# Altium project PCB_Projectmain.PrjPCB
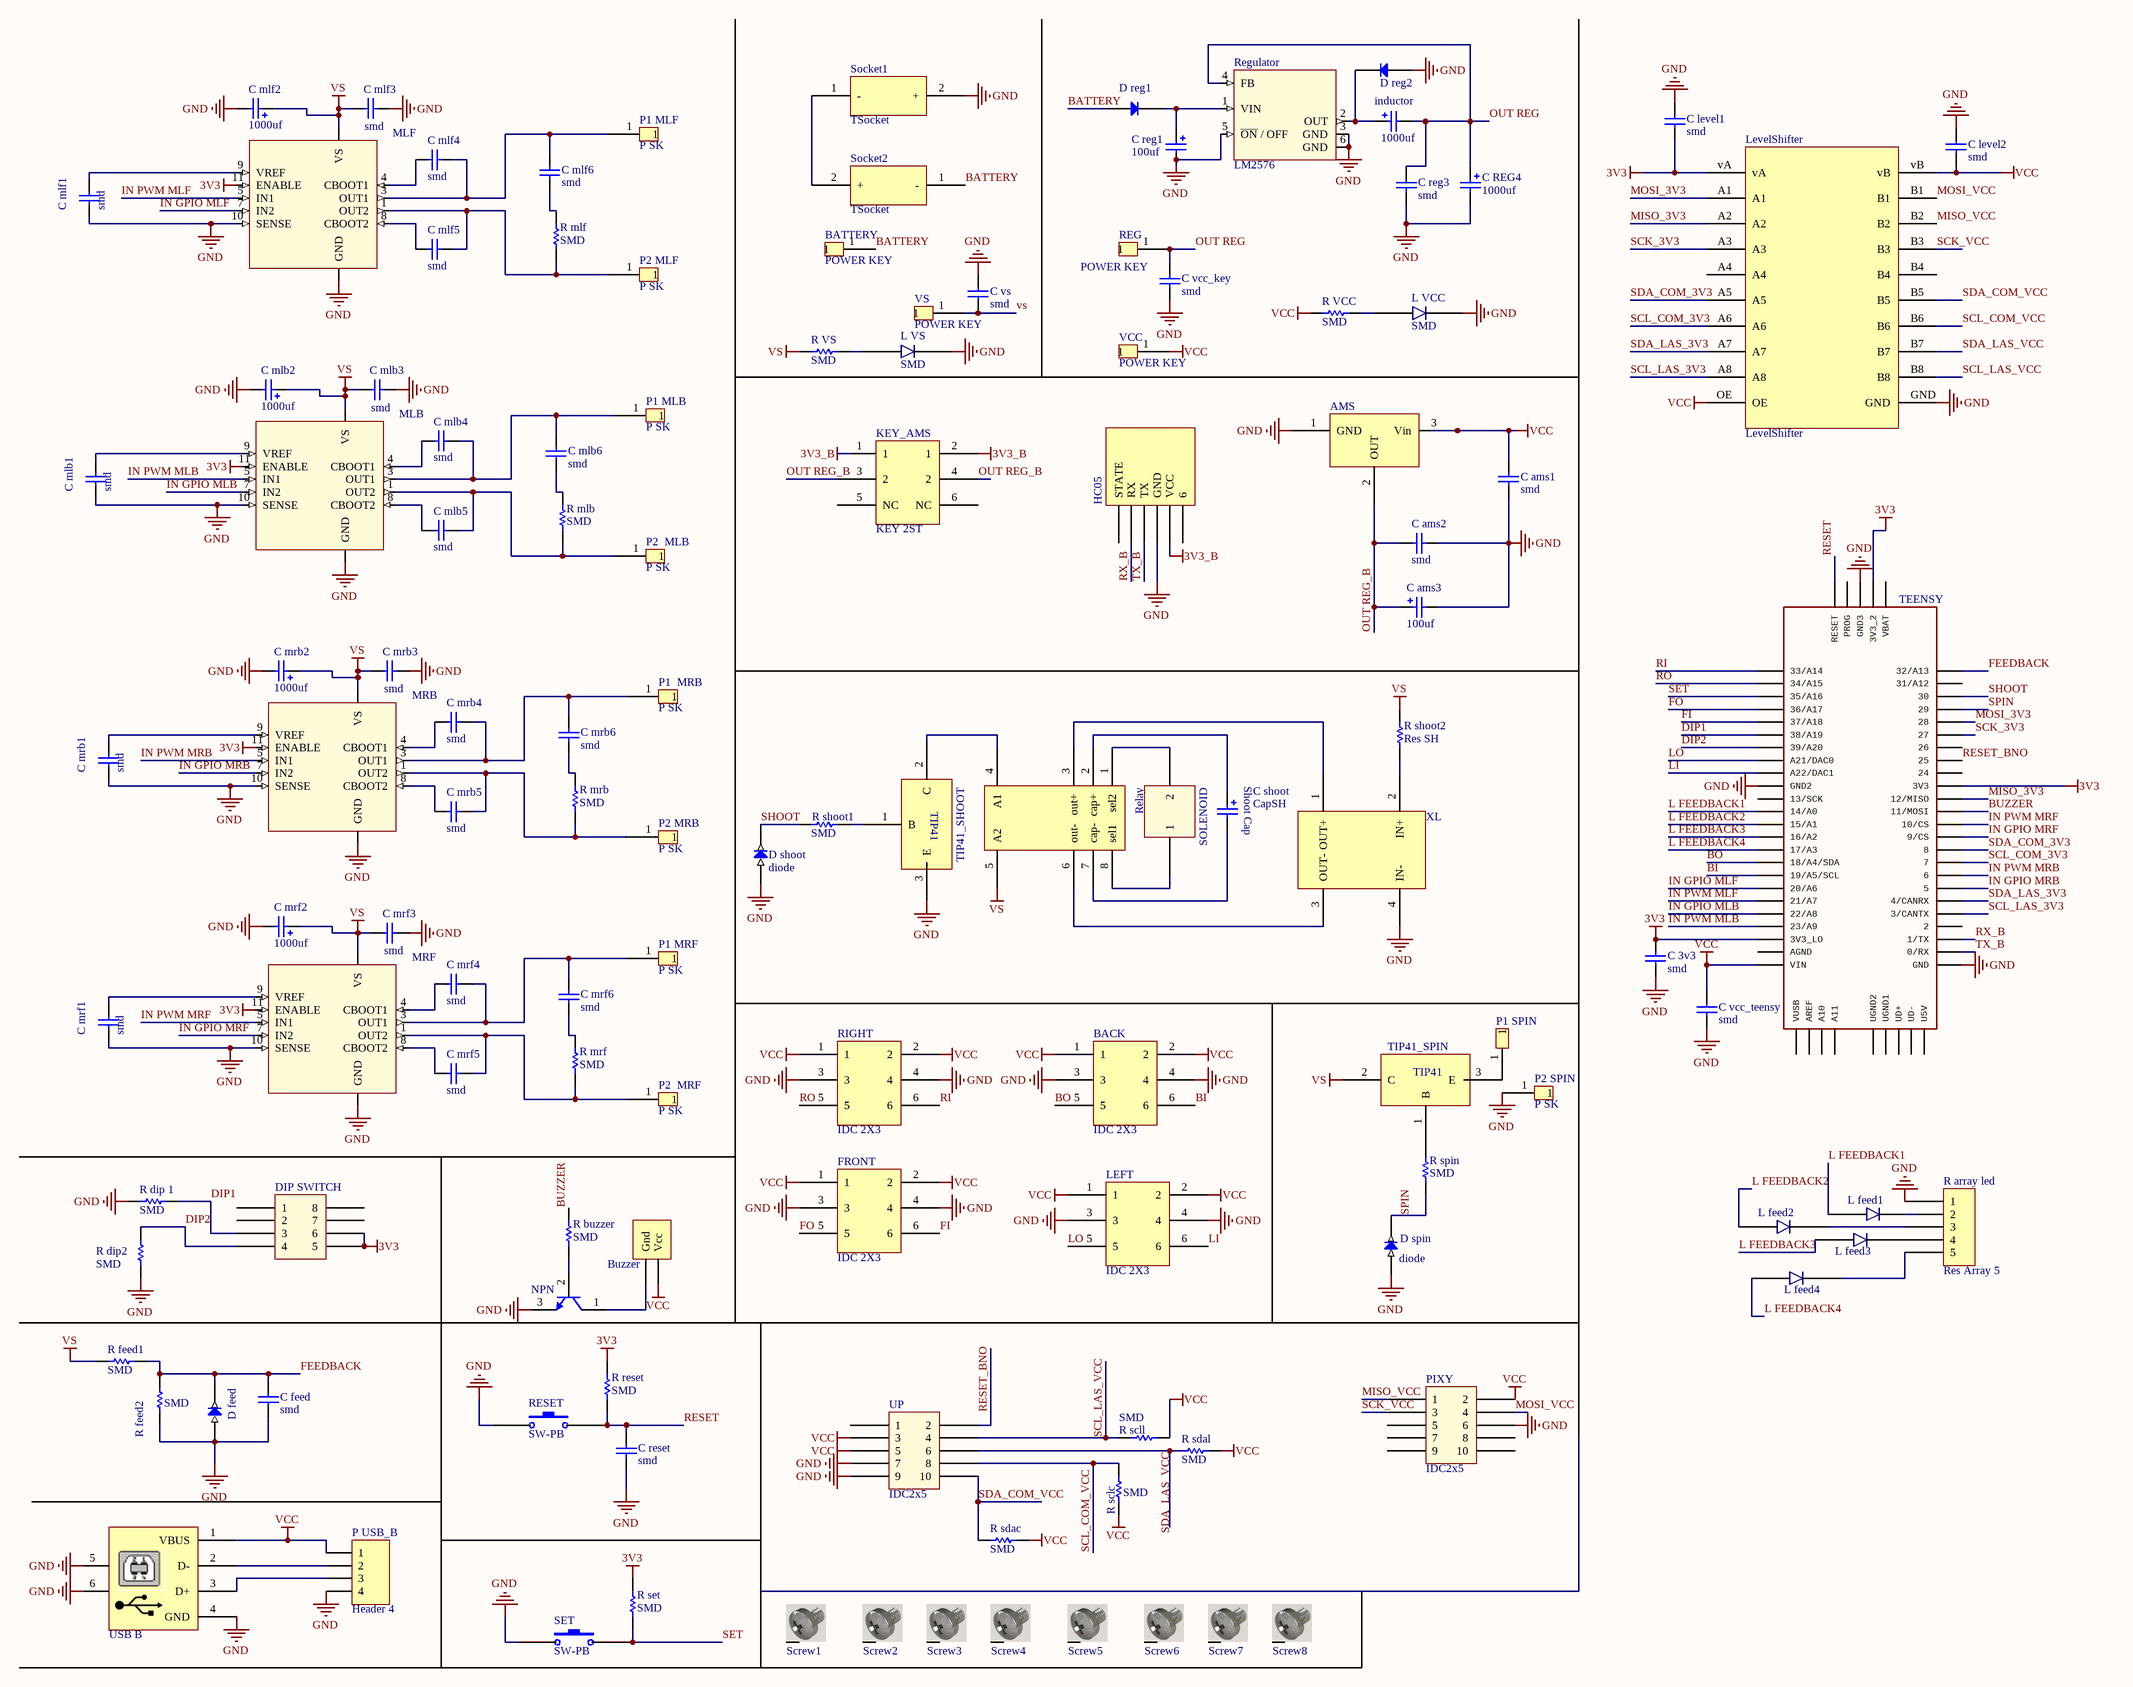
[diagram p0: main schematic.SchDoc]
1 sheet, 124 parts. Net scope: global (net labels, ports and power ports of the same name join across sheets).
Board file: main PCB .PcbDoc

## Sheet main schematic.SchDoc
size A0

### Parts
AMS  AMS1117  [SOT223]  (value not drawn)
BACK  IDC 2X3  [IDC 2X3]
BATTERY  POWER KEY  [P SK]
Buzzer  Buzzer  [Buzzer]  (value not drawn)
C_3v3  smd  [Cap SMD]
C_ams1  smd  [Cap SMD]
C_ams2  smd  [Cap SMD]
C_ams3  100uf  [Cap 100uF]
C_feed  smd  [Cap SMD]
C_level1  smd  [Cap SMD]
C_level2  smd  [Cap SMD]
C_mlb1  smd  [Cap SMD]
C_mlb2  1000uf  [Cap 1000uf]
C_mlb3  smd  [Cap SMD]
C_mlb4  smd  [Cap SMD]
C_mlb5  smd  [Cap SMD]
C_mlb6  smd  [Cap SMD]
C_mlf1  smd  [Cap SMD]
C_mlf2  1000uf  [Cap 1000uf]
C_mlf3  smd  [Cap SMD]
C_mlf4  smd  [Cap SMD]
C_mlf5  smd  [Cap SMD]
C_mlf6  smd  [Cap SMD]
C_mrb1  smd  [Cap SMD]
C_mrb2  1000uf  [Cap 1000uf]
C_mrb3  smd  [Cap SMD]
C_mrb4  smd  [Cap SMD]
C_mrb5  smd  [Cap SMD]
C_mrb6  smd  [Cap SMD]
C_mrf1  smd  [Cap SMD]
C_mrf2  1000uf  [Cap 1000uf]
C_mrf3  smd  [Cap SMD]
C_mrf4  smd  [Cap SMD]
C_mrf5  smd  [Cap SMD]
C_mrf6  smd  [Cap SMD]
C_reg1  100uf  [Cap 100uF]
C_reg3  smd  [Cap SMD]
C_REG4  1000uf  [Cap 1000uf]
C_reset  smd  [Cap SMD]
C_shoot  CapSH  [Cap SH]
C_vcc_key  smd  [Cap SMD]
C_vcc_teensy  smd  [Cap SMD]
C_vs  smd  [Cap SMD]
D_feed  (no value)  [LED SMD]
D_reg1  Diode  [Diode]  (value not drawn)
D_reg2  Diode  [Diode]  (value not drawn)
D_shoot  diode  [LED SMD]
D_spin  diode  [LED SMD]
DIP_SWITCH  DIP4  [DIP SW4]  (value not drawn)
FRONT  IDC 2X3  [IDC 2X3]
HC05  HC05  [HC05]
inductor  1000uf  [Cap 1000uf]
KEY_AMS  KEY 2ST  [KEY 2ST]
L_feed1  SMD  [LED SMD]  (value not drawn)
L_feed2  SMD  [LED SMD]  (value not drawn)
L_feed3  SMD  [LED SMD]  (value not drawn)
L_feed4  SMD  [LED SMD]  (value not drawn)
L_VCC  SMD  [LED SMD]
L_VS  SMD  [LED SMD]
LEFT  IDC 2X3  [IDC 2X3]
LevelShifter  LevelShifter  [CJMCU]
MLB  L6203  [MultiWatt11]  (value not drawn)
MLF  L6203  [MultiWatt11]  (value not drawn)
MRB  L6203  [MultiWatt11]  (value not drawn)
MRF  L6203  [MultiWatt11]  (value not drawn)
NPN  N2222A  [NPN]  (value not drawn)
P1_MLB  P SK  [P SK]
P1_MLF  P SK  [P SK]
P1_MRB  P SK  [P SK]
P1_MRF  P SK  [P SK]
P1_SPIN  P SK  [P SK]  (value not drawn)
P2_MLB  P SK  [P SK]
P2_MLF  P SK  [P SK]
P2_MRB  P SK  [P SK]
P2_MRF  P SK  [P SK]
P2_SPIN  P SK  [P SK]
P_USB_B  Header 4  [HDR1X4]
PIXY  IDC2x5  [IDC 2x5]
R_array_led  Res Array 5  [Res Array 5]
R_buzzer  SMD  [Resistor SMD 1206]
R_dip2  SMD  [Resistor SMD 1206]
R_dip_1  SMD  [Resistor SMD 1206]
R_feed1  SMD  [Resistor SMD 1206]
R_feed2  SMD  [Resistor SMD 1206]
R_mlb  SMD  [Resistor SMD 1206]
R_mlf  SMD  [Resistor SMD 1206]
R_mrb  SMD  [Resistor SMD 1206]
R_mrf  SMD  [Resistor SMD 1206]
R_reset  SMD  [Resistor SMD 1206]
R_sclc  SMD  [Resistor SMD 1206]
R_scll  SMD  [Resistor SMD 1206]
R_sdac  SMD  [Resistor SMD 1206]
R_sdal  SMD  [Resistor SMD 1206]
R_set  SMD  [Resistor SMD 1206]
R_shoot1  SMD  [Resistor SMD 1206]
R_shoot2  Res SH  [Res SH]
R_spin  SMD  [Resistor SMD 1206]
R_VCC  SMD  [Resistor SMD 1206]
R_VS  SMD  [Resistor SMD 1206]
REG  POWER KEY  [P SK]
Regulator  LM2576  [D2PAK]
Relay  Relay SH  [Relay SH]  (value not drawn)
RESET  SW-PB  [SW_2pin]
RIGHT  IDC 2X3  [IDC 2X3]
Screw1  Screw  [Screw]  (value not drawn)
Screw2  Screw  [Screw]  (value not drawn)
Screw3  Screw  [Screw]  (value not drawn)
Screw4  Screw  [Screw]  (value not drawn)
Screw5  Screw  [Screw]  (value not drawn)
Screw6  Screw  [Screw]  (value not drawn)
Screw7  Screw  [Screw]  (value not drawn)
Screw8  Screw  [Screw]  (value not drawn)
SET  SW-PB  [SW_2pin]
Socket1  TSocket  [TSocket]
Socket2  TSocket  [TSocket]
SOLENOID  Selon  [Selon Con]  (value not drawn)
TEENSY  TEENSY_3.5/3.6  [TEENSY_3.5/3.6]  (value not drawn)
TIP41  TIP41_SHOOT  [TIP41]
TIP41_SPIN  TIP41  [TIP41]  (value not drawn)
UP  IDC2x5  [IDC 2x5]
USB_B  USB_B  [USB_B.1]  (value not drawn)
VCC  POWER KEY  [P SK]
VS  POWER KEY  [P SK]
XL  XL6009  [XL6009]  (value not drawn)

### Nets
3V3: C_3v3.1 C_level1.1 DIP_SWITCH.5 DIP_SWITCH.6 LevelShifter.vA MLB.11(ENABLE) MLF.11(ENABLE) MRB.11(ENABLE) MRF.11(ENABLE) R_reset.2 R_set.2 TEENSY.3V3 TEENSY.3V3_2 TEENSY.3V3_LO
3V3_B: HC05.5(VCC) KEY_AMS.1 KEY_AMS.2(1)
GND: AMS.1(GND) BACK.3 BACK.4 C_3v3.2 C_ams1.1 C_ams2.1 C_ams3.2 C_feed.1 C_level1.2 C_level2.2 C_mlb1.1 C_mlb2.2 C_mlb3.2 C_mlf1.1 C_mlf2.2 C_mlf3.2 C_mrb1.1 C_mrb2.2 C_mrb3.2 C_mrf1.1 C_mrf2.2 C_mrf3.2 C_reg1.2 C_reg3.1 C_REG4.2 C_reset.1 C_vcc_key.2 C_vcc_teensy.2 C_vs.1 D_feed.1(in) D_reg2.1(A) D_shoot.1(in) D_spin.1(in) FRONT.3 FRONT.4 HC05.4(GND) L_VCC.2 L_VS.2 LEFT.3 LEFT.4 LevelShifter.GND MLB.6(GND) MLB.10(SENSE) MLF.6(GND) MLF.10(SENSE) MRB.6(GND) MRB.10(SENSE) MRF.6(GND) MRF.10(SENSE) NPN.3(E) P2_SPIN.1 P_USB_B.4 PIXY.6 R_array_led.1 R_dip2.1 R_dip_1.1 R_feed2.1 Regulator.3(GND) Regulator.5(~{ON}_/_OFF) Regulator.6(GND) RESET.2 RIGHT.3 RIGHT.4 SET.2 Socket1.2(+) TEENSY.GND TEENSY.GND2 TEENSY.GND3 TIP41.3(E) UP.7 UP.9 USB_B.4(GND) USB_B.5 USB_B.6 XL.4(IN-)
VCC: AMS.3(Vin) BACK.1 BACK.2 Buzzer.1(Vcc) C_ams1.2 C_level2.1 C_vcc_teensy.1 FRONT.1 FRONT.2 LEFT.1 LEFT.2 LevelShifter.OE LevelShifter.vB P_USB_B.1 PIXY.2 R_sclc.1 R_scll.2 R_sdac.2 R_sdal.2 R_VCC.1 RIGHT.1 RIGHT.2 TEENSY.VIN UP.3 UP.5 USB_B.1(VBUS) VCC.1
vs: C_mlb2.1 C_mlb3.1 C_mlf2.1 C_mlf3.1 C_mrb2.1 C_mrb3.1 C_mrf2.1 C_mrf3.1 C_vs.2 MLB.2(VS) MLF.2(VS) MRB.2(VS) MRF.2(VS) R_feed1.1 R_shoot2.1 R_VS.1 Relay.5(A2) TIP41_SPIN.2(C) VS.1
BATTERY: BATTERY.1 D_reg1.1(A) Socket2.1(-)
BI: BACK.6 TEENSY.19/A5/SCL
BO: BACK.5 TEENSY.18/A4/SDA
BUZZER: R_buzzer.2 TEENSY.11/MOSI
DIP1: DIP_SWITCH.3 R_dip_1.2 TEENSY.38/A19
DIP2: DIP_SWITCH.4 R_dip2.2 TEENSY.39/A20
FEEDBACK: C_feed.2 D_feed.2(out) R_feed1.2 R_feed2.2 TEENSY.32/A13
FI: FRONT.6 TEENSY.37/A18
FO: FRONT.5 TEENSY.36/A17
IN GPIO MLB: MLB.7(IN2) TEENSY.22/A8
IN GPIO MLF: MLF.7(IN2) TEENSY.20/A6
IN GPIO MRB: MRB.7(IN2) TEENSY.5
IN GPIO MRF: MRF.7(IN2) TEENSY.9/CS
IN PWM MLB: MLB.5(IN1) TEENSY.23/A9
IN PWM MLF: MLF.5(IN1) TEENSY.21/A7
IN PWM MRB: MRB.5(IN1) TEENSY.6
IN PWM MRF: MRF.5(IN1) TEENSY.10/CS
L FEEDBACK1: L_feed1.1 TEENSY.14/A0
L FEEDBACK2: L_feed2.1 TEENSY.15/A1
L FEEDBACK3: L_feed3.1 TEENSY.16/A2
L FEEDBACK4: L_feed4.1 TEENSY.17/A3
LI: LEFT.6 TEENSY.A22/DAC1
LO: LEFT.5 TEENSY.21/DAC0(A21/DAC0)
MISO_3V3: LevelShifter.A2 TEENSY.12/MISO
MISO_VCC: LevelShifter.B2 PIXY.1
MOSI_3V3: LevelShifter.A1 TEENSY.28
MOSI_VCC: LevelShifter.B1 PIXY.4
OUT REG: C_reg3.2 C_REG4.1 C_vcc_key.1 inductor.2 REG.1 Regulator.4(FB)
OUT REG_B: AMS.2(OUT) C_ams2.2 C_ams3.1 KEY_AMS.3(2) KEY_AMS.4(2)
RESET: C_reset.2 R_reset.1 RESET.1 TEENSY.RESET
RESET_BNO: TEENSY.25 UP.2
RI: RIGHT.6 TEENSY.33/A14
RO: RIGHT.5 TEENSY.34/A15
RX_B: HC05.2(RX) TEENSY.1/TX
SCK_3V3: LevelShifter.A3 TEENSY.27
SCK_VCC: LevelShifter.B3 PIXY.3
SCL_COM_3V3: LevelShifter.A6 TEENSY.7
SCL_COM_VCC: LevelShifter.B6 R_sclc.2 UP.8
SCL_LAS_3V3: LevelShifter.A8 TEENSY.3/CANTX
SCL_LAS_VCC: LevelShifter.B8 R_scll.1 UP.4
SDA_COM_3V3: LevelShifter.A5 TEENSY.8
SDA_COM_VCC: LevelShifter.B5 R_sdac.1 UP.10
SDA_LAS_3V3: LevelShifter.A7 TEENSY.4/CANRX
SDA_LAS_VCC: LevelShifter.B7 R_sdal.1 UP.6
SET: R_set.1 SET.1 TEENSY.35/A16
SHOOT: D_shoot.2(out) R_shoot1.1 TEENSY.30
SPIN: D_spin.2(out) R_spin.1 TEENSY.29
TX_B: HC05.3(TX) TEENSY.0/RX
NetBuzzer_2: Buzzer.2(Gnd) NPN.1(C)
NetC_mlb1_2: C_mlb1.2 MLB.9(VREF)
NetC_mlb4_1: C_mlb4.1 MLB.4(CBOOT1)
NetC_mlb4_2: C_mlb4.2 C_mlb6.2 MLB.3(OUT1) P1_MLB.1
NetC_mlb5_1: C_mlb5.1 MLB.8(CBOOT2)
NetC_mlb5_2: C_mlb5.2 MLB.1(OUT2) P2_MLB.1 R_mlb.1
NetC_mlb6_1: C_mlb6.1 R_mlb.2
NetC_mlf1_2: C_mlf1.2 MLF.9(VREF)
NetC_mlf4_1: C_mlf4.1 MLF.4(CBOOT1)
NetC_mlf4_2: C_mlf4.2 C_mlf6.2 MLF.3(OUT1) P1_MLF.1
NetC_mlf5_1: C_mlf5.1 MLF.8(CBOOT2)
NetC_mlf5_2: C_mlf5.2 MLF.1(OUT2) P2_MLF.1 R_mlf.1
NetC_mlf6_1: C_mlf6.1 R_mlf.2
NetC_mrb1_2: C_mrb1.2 MRB.9(VREF)
NetC_mrb4_1: C_mrb4.1 MRB.4(CBOOT1)
NetC_mrb4_2: C_mrb4.2 C_mrb6.2 MRB.3(OUT1) P1_MRB.1
NetC_mrb5_1: C_mrb5.1 MRB.8(CBOOT2)
NetC_mrb5_2: C_mrb5.2 MRB.1(OUT2) P2_MRB.1 R_mrb.1
NetC_mrb6_1: C_mrb6.1 R_mrb.2
NetC_mrf1_2: C_mrf1.2 MRF.9(VREF)
NetC_mrf4_1: C_mrf4.1 MRF.4(CBOOT1)
NetC_mrf4_2: C_mrf4.2 C_mrf6.2 MRF.3(OUT1) P1_MRF.1
NetC_mrf5_1: C_mrf5.1 MRF.8(CBOOT2)
NetC_mrf5_2: C_mrf5.2 MRF.1(OUT2) P2_MRF.1 R_mrf.1
NetC_mrf6_1: C_mrf6.1 R_mrf.2
NetC_reg1_1: C_reg1.1 D_reg1.2(K) Regulator.1(VIN)
NetC_shoot_1: C_shoot.1 Relay.2(cap+)
NetC_shoot_2: C_shoot.2 Relay.7(cap-)
NetD_reg2_2: D_reg2.2(K) inductor.1 Regulator.2(OUT)
NetL_feed1_2: L_feed1.2 R_array_led.2
NetL_feed2_2: L_feed2.2 R_array_led.3
NetL_feed3_2: L_feed3.2 R_array_led.4
NetL_feed4_2: L_feed4.2 R_array_led.5
NetL_VCC_1: L_VCC.1 R_VCC.2
NetL_VS_1: L_VS.1 R_VS.2
NetNPN_2: NPN.2(B) R_buzzer.1
NetP1_SPIN_1: P1_SPIN.1 TIP41_SPIN.3(E)
NetP_USB_B_2: P_USB_B.2 USB_B.2(D-)
NetP_USB_B_3: P_USB_B.3 USB_B.3(D+)
NetR_shoot1_2: R_shoot1.2 TIP41.1(B)
NetR_shoot2_2: R_shoot2.2 XL.2(IN+)
NetR_spin_2: R_spin.2 TIP41_SPIN.1(B)
NetRelay_1: Relay.1(sel2) SOLENOID.2
NetRelay_3: Relay.3(out+) XL.1(OUT+)
NetRelay_4: Relay.4(A1) TIP41.2(C)
NetRelay_6: Relay.6(out-) XL.3(OUT-)
NetRelay_8: Relay.8(sel1) SOLENOID.1
NetSocket1_1: Socket1.1(-) Socket2.2(+)

Not connected (* = marked no-connect by the designer): DIP_SWITCH 1 2 7 8; HC05 1(STATE) 6; KEY_AMS 5(NC) 6(NC); LevelShifter A4 B4; PIXY 5 7 8 9 10; Screw1 S; Screw2 S; Screw3 S; Screw4 S; Screw5 S; Screw6 S; Screw7 S; Screw8 S; TEENSY 2 13/SCK 24 26 31/A12 A10 A11 AGND AREF PROG U5V UD+ UD- UGND1 UGND2 VBAT VUSB; UP 1

### Notes on the sheet
- (in symbol CapSH) Shoot Cap

### Library data of the parts
BATTERY REG VCC VS = P SK
C_3v3 C_ams1 C_ams2 C_feed C_level1 C_level2 C_mlb1 C_mlb3-C_mlb6 C_mlf1 C_mlf3-C_mlf6 C_mrb1 C_mrb3-C_mrb6 C_mrf1 C_mrf3-C_mrf6 C_reg3 C_reset C_vcc_key C_vcc_teensy C_vs = Cap SMD
C_ams3 C_reg1 = Cap 100uF
C_mlb2 C_mlf2 C_mrb2 C_mrf2 C_REG4 inductor = Cap 1000uF
D_feed D_shoot D_spin = SMDZenerDiode
DIP_SWITCH = DIP SW 4
L_feed1-L_feed4 L_VCC L_VS = LED SMD
NPN = NPN
P_USB_B = Header 4: Header, 4-Pin; LatestRevisionDate: 17-Jul-2002; LatestRevisionNote: Re-released for DXP Platform.; Publisher: Altium Limited
PIXY UP = IDC 2x5
R_buzzer R_dip2 R_dip_1 R_feed1 R_feed2 R_mlb R_mlf R_mrb R_mrf R_reset R_sclc R_scll R_sdac R_sdal R_set R_shoot1 R_spin R_VCC R_VS = Res SMD
RESET SET = SW-PB: Switch; Published: 24-Mar-1999; LatestRevisionDate: 17-Jul-2002; LatestRevisionNote: Re-released for DXP Platform.; PackageReference: SPST-2; Publisher: Altium Limited; PackageDescription: Switch; 2 Leads
TEENSY = TEENSY_3.5/3.6: GateName_1: G$1; SymbolName_1: TEENSY_3.5/3.6; LibraryName: Teensy356; DeviceSetName: TEENSY_3.5/3.6; Package: TEENSY_3.5/3.6
TIP41 = TIP41
USB_B = USB_B: USB B; LatestRevisionDate: 17-Jul-2002; LatestRevisionNote: Re-released for DXP Platform.; Publisher: Altium Limited
Screw1-Screw8 = Screw: LatestRevisionDate: 17-Jul-2002; LatestRevisionNote: Re-released for DXP Platform.; Publisher: Altium Limited